# Altium project Z20X_Expansion.PrjPcb
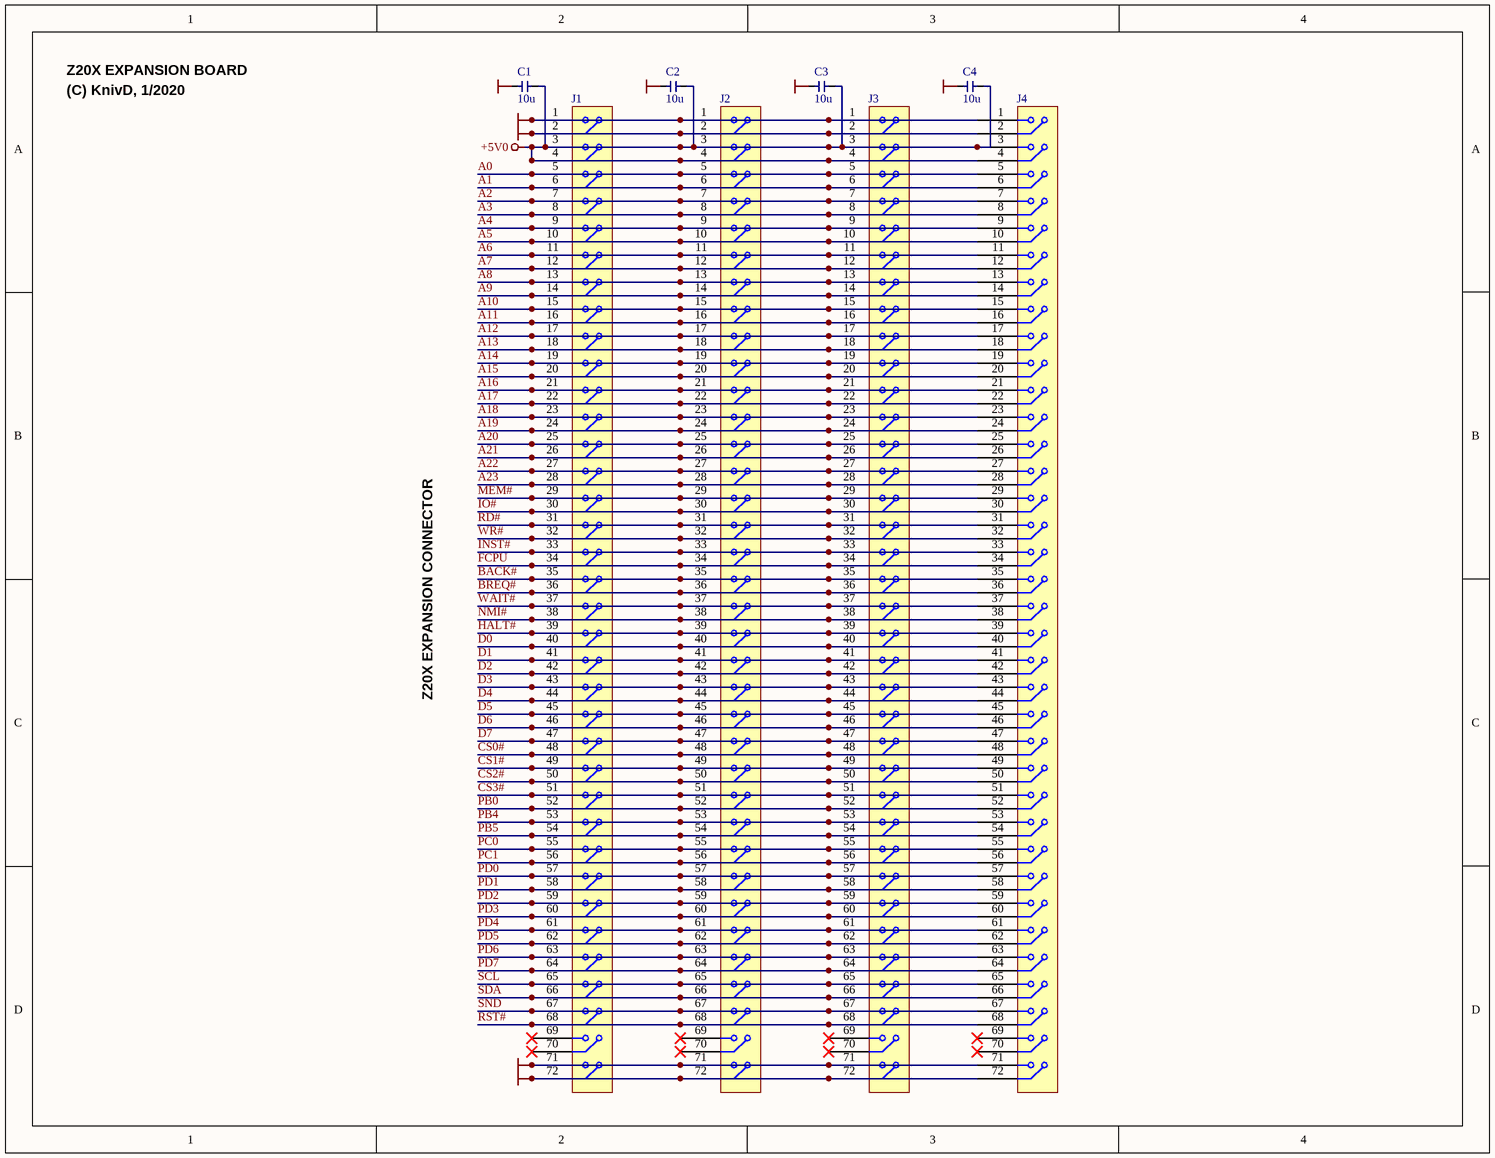
[diagram p0: main.SchDoc]
1 sheet, 8 parts. Net scope: global (net labels, ports and power ports of the same name join across sheets).
Board file: PCB.PcbDoc

## Sheet main.SchDoc: ELLO TROLL
size Letter; Author: KnivD; DrawnBy: KnivD; Engineer: KnivD; DocumentNumber: 1; Revision: 1704; SheetNumber: 1; SheetTotal: 1; ProjectName: ELLO TROLL

### Parts
C1  10u  [CAPRR508-350X500X500]
C2  10u  [CAPRR508-350X500X500]
C3  10u  [CAPRR508-350X500X500]
C4  10u  [CAPRR508-350X500X500]
J1  (no value)  [2011-2X36S-F]
J2  (no value)  [2011-2X36S-F]
J3  (no value)  [2011-2X36S-F]
J4  (no value)  [2011-2X36S-F]

### Nets
+5V0: C1.1 C2.1 C3.1 C4.1 J1.3 J1.4 J2.3 J2.4 J3.3 J3.4 J4.3 J4.4
GND: C1.2 C2.2 C3.2 C4.2 J1.1 J1.2 J1.71 J1.72 J2.1 J2.2 J2.71 J2.72 J3.1 J3.2 J3.71 J3.72 J4.1 J4.2 J4.71 J4.72
A0: J1.5 J2.5 J3.5 J4.5
A1: J1.6 J2.6 J3.6 J4.6
A2: J1.7 J2.7 J3.7 J4.7
A3: J1.8 J2.8 J3.8 J4.8
A4: J1.9 J2.9 J3.9 J4.9
A5: J1.10 J2.10 J3.10 J4.10
A6: J1.11 J2.11 J3.11 J4.11
A7: J1.12 J2.12 J3.12 J4.12
A8: J1.13 J2.13 J3.13 J4.13
A9: J1.14 J2.14 J3.14 J4.14
A10: J1.15 J2.15 J3.15 J4.15
A11: J1.16 J2.16 J3.16 J4.16
A12: J1.17 J2.17 J3.17 J4.17
A13: J1.18 J2.18 J3.18 J4.18
A14: J1.19 J2.19 J3.19 J4.19
A15: J1.20 J2.20 J3.20 J4.20
A16: J1.21 J2.21 J3.21 J4.21
A17: J1.22 J2.22 J3.22 J4.22
A18: J1.23 J2.23 J3.23 J4.23
A19: J1.24 J2.24 J3.24 J4.24
A20: J1.25 J2.25 J3.25 J4.25
A21: J1.26 J2.26 J3.26 J4.26
A22: J1.27 J2.27 J3.27 J4.27
A23: J1.28 J2.28 J3.28 J4.28
BACK#: J1.35 J2.35 J3.35 J4.35
BREQ#: J1.36 J2.36 J3.36 J4.36
CS0#: J1.48 J2.48 J3.48 J4.48
CS1#: J1.49 J2.49 J3.49 J4.49
CS2#: J1.50 J2.50 J3.50 J4.50
CS3#: J1.51 J2.51 J3.51 J4.51
D0: J1.40 J2.40 J3.40 J4.40
D1: J1.41 J2.41 J3.41 J4.41
D2: J1.42 J2.42 J3.42 J4.42
D3: J1.43 J2.43 J3.43 J4.43
D4: J1.44 J2.44 J3.44 J4.44
D5: J1.45 J2.45 J3.45 J4.45
D6: J1.46 J2.46 J3.46 J4.46
D7: J1.47 J2.47 J3.47 J4.47
FCPU: J1.34 J2.34 J3.34 J4.34
HALT#: J1.39 J2.39 J3.39 J4.39
INST#: J1.33 J2.33 J3.33 J4.33
IO#: J1.30 J2.30 J3.30 J4.30
MEM#: J1.29 J2.29 J3.29 J4.29
NMI#: J1.38 J2.38 J3.38 J4.38
PB0: J1.52 J2.52 J3.52 J4.52
PB4: J1.53 J2.53 J3.53 J4.53
PB5: J1.54 J2.54 J3.54 J4.54
PC0: J1.55 J2.55 J3.55 J4.55
PC1: J1.56 J2.56 J3.56 J4.56
PD0: J1.57 J2.57 J3.57 J4.57
PD1: J1.58 J2.58 J3.58 J4.58
PD2: J1.59 J2.59 J3.59 J4.59
PD3: J1.60 J2.60 J3.60 J4.60
PD4: J1.61 J2.61 J3.61 J4.61
PD5: J1.62 J2.62 J3.62 J4.62
PD6: J1.63 J2.63 J3.63 J4.63
PD7: J1.64 J2.64 J3.64 J4.64
RD#: J1.31 J2.31 J3.31 J4.31
RST#: J1.68 J2.68 J3.68 J4.68
SCL: J1.65 J2.65 J3.65 J4.65
SDA: J1.66 J2.66 J3.66 J4.66
SND: J1.67 J2.67 J3.67 J4.67
WAIT#: J1.37 J2.37 J3.37 J4.37
WR#: J1.32 J2.32 J3.32 J4.32

Not connected (* = marked no-connect by the designer): J1 69* 70*; J2 69* 70*; J3 69* 70*; J4 69* 70*

### Notes on the sheet
- Z20X EXPANSION BOARD
- (C) KnivD, 1/2020
- Z20X EXPANSION CONNECTOR

### Library data of the parts
C1-C4 = Capacitor
J1-J4 = Connector 2x36: Dual row, 72-way connector